# EAGLE design Resume&LinkedIn(PCBboard) (EAGLE 9.3.2)
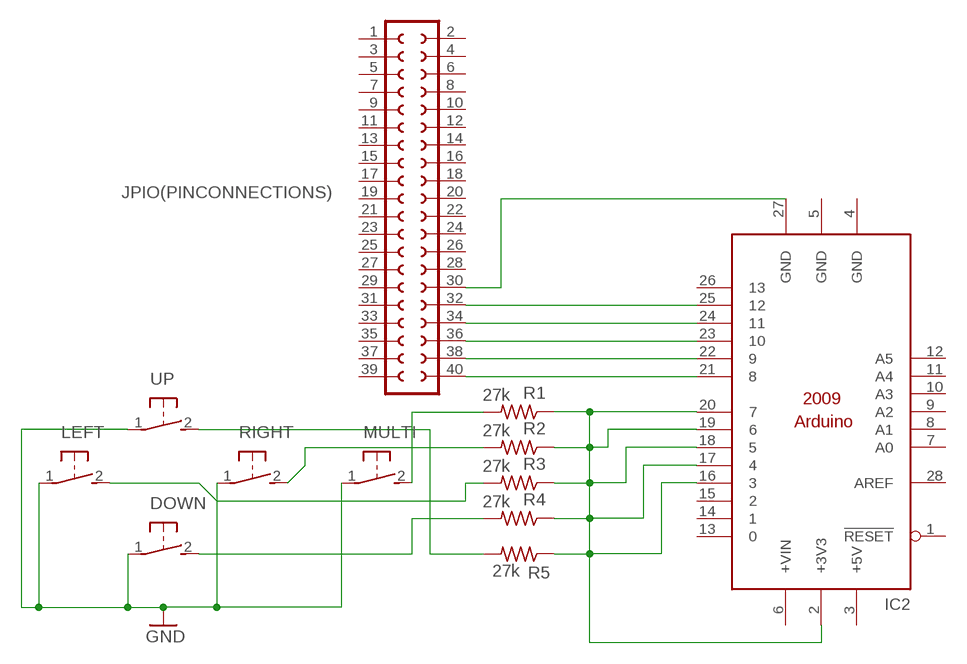
[diagram p0: schematic, sheet 1]

## Parts
DOWN  31-XX  [B3F-31XX]
IC2  ARDUINO2009_10  [ARDUINO2009]
JPIO(PINCONNECTIONS)  SOCKET-40V  [S40V]
LEFT  31-XX  [B3F-31XX]
MULTI  31-XX  [B3F-31XX]
R1  27k  R-US_0204/5  [0204/5]
R2  27k  R-US_0204/5  [0204/5]
R3  27k  R-US_0204/5  [0204/5]
R4  27k  R-US_0204/5  [0204/5]
R5  27k  R-US_0204/5  [0204/5]
RIGHT  31-XX  [B3F-31XX]
UP  31-XX  [B3F-31XX]

## Nets
GND: DOWN.1(P) LEFT.1(P) MULTI.1(P) RIGHT.1(P) UP.1(P)
N$1: IC2.21 JPIO(PINCONNECTIONS).40
N$2: IC2.22 JPIO(PINCONNECTIONS).38
N$3: IC2.23 JPIO(PINCONNECTIONS).36
N$4: IC2.24 JPIO(PINCONNECTIONS).34
N$5: IC2.25 JPIO(PINCONNECTIONS).32
N$6: IC2.27(GND) JPIO(PINCONNECTIONS).30
N$7: IC2.2(+3V3) IC2.16 IC2.17 IC2.18 IC2.19 IC2.20 R1.1 R2.1 R3.1 R4.1 R5.1
N$12: R5.2 UP.2(S)
N$13: DOWN.2(S) R4.2
N$14: LEFT.2(S) R3.2
N$15: R2.2 RIGHT.2(S)
N$16: MULTI.2(S) R1.2
Unconnected: IC2.1(!RESET) IC2.6(+VIN) IC2.7(A0) IC2.8(A1) IC2.9(A2) IC2.10(A3) IC2.11(A4) IC2.12(A5) IC2.13 IC2.14 IC2.15 IC2.26 IC2.28(AREF) JPIO(PINCONNECTIONS).1 JPIO(PINCONNECTIONS).2 JPIO(PINCONNECTIONS).3 JPIO(PINCONNECTIONS).4 JPIO(PINCONNECTIONS).5 JPIO(PINCONNECTIONS).6 JPIO(PINCONNECTIONS).7 JPIO(PINCONNECTIONS).8 JPIO(PINCONNECTIONS).9 JPIO(PINCONNECTIONS).10 JPIO(PINCONNECTIONS).11 JPIO(PINCONNECTIONS).12 JPIO(PINCONNECTIONS).13 JPIO(PINCONNECTIONS).14 JPIO(PINCONNECTIONS).15 JPIO(PINCONNECTIONS).16 JPIO(PINCONNECTIONS).17 JPIO(PINCONNECTIONS).18 JPIO(PINCONNECTIONS).19 JPIO(PINCONNECTIONS).20 JPIO(PINCONNECTIONS).21 JPIO(PINCONNECTIONS).22 JPIO(PINCONNECTIONS).23 JPIO(PINCONNECTIONS).24 JPIO(PINCONNECTIONS).25 JPIO(PINCONNECTIONS).26 JPIO(PINCONNECTIONS).27 JPIO(PINCONNECTIONS).28 JPIO(PINCONNECTIONS).29 JPIO(PINCONNECTIONS).31 JPIO(PINCONNECTIONS).33 JPIO(PINCONNECTIONS).35 JPIO(PINCONNECTIONS).37 JPIO(PINCONNECTIONS).39

## Power pins joined to a net without a drawn wire
+5V: IC2.3(+5V)
GND: IC2.4(GND) IC2.5(GND)

## Library data of the parts
DOWN LEFT MULTI RIGHT UP = switch-omron:31-XX: OMRON SWITCH; MPN: B3F-3100; OC_FARNELL: 959704; OC_NEWARK: 36M3582
IC2 = arduino:ARDUINO2009_1: The Arduino Duemilanove ("2009") is a microcontroller board based on the ATmega168 or ATmega328. - 14 digital input/output pins (of which 6 can be used as PWM outputs) - 6 analog inputs, a 16 MHz crystal oscillator - USB connection - power jack - ISP header - reset button It contains everything needed to support the microcontroller; simply connect it to a computer with a USB cable or power it with a AC-to-DC adapter or battery to get started http://arduino.cc/en/Main/ArduinoBoardDuemilanove
JPIO(PINCONNECTIONS) = con-3m-skt-header:SOCKET-40: 40 pin PCB Socket (3m 85xx/51xx)
R1-R5 = rcl:R-US_: RESISTOR, American symbol; SPICEPREFIX: R

## Board
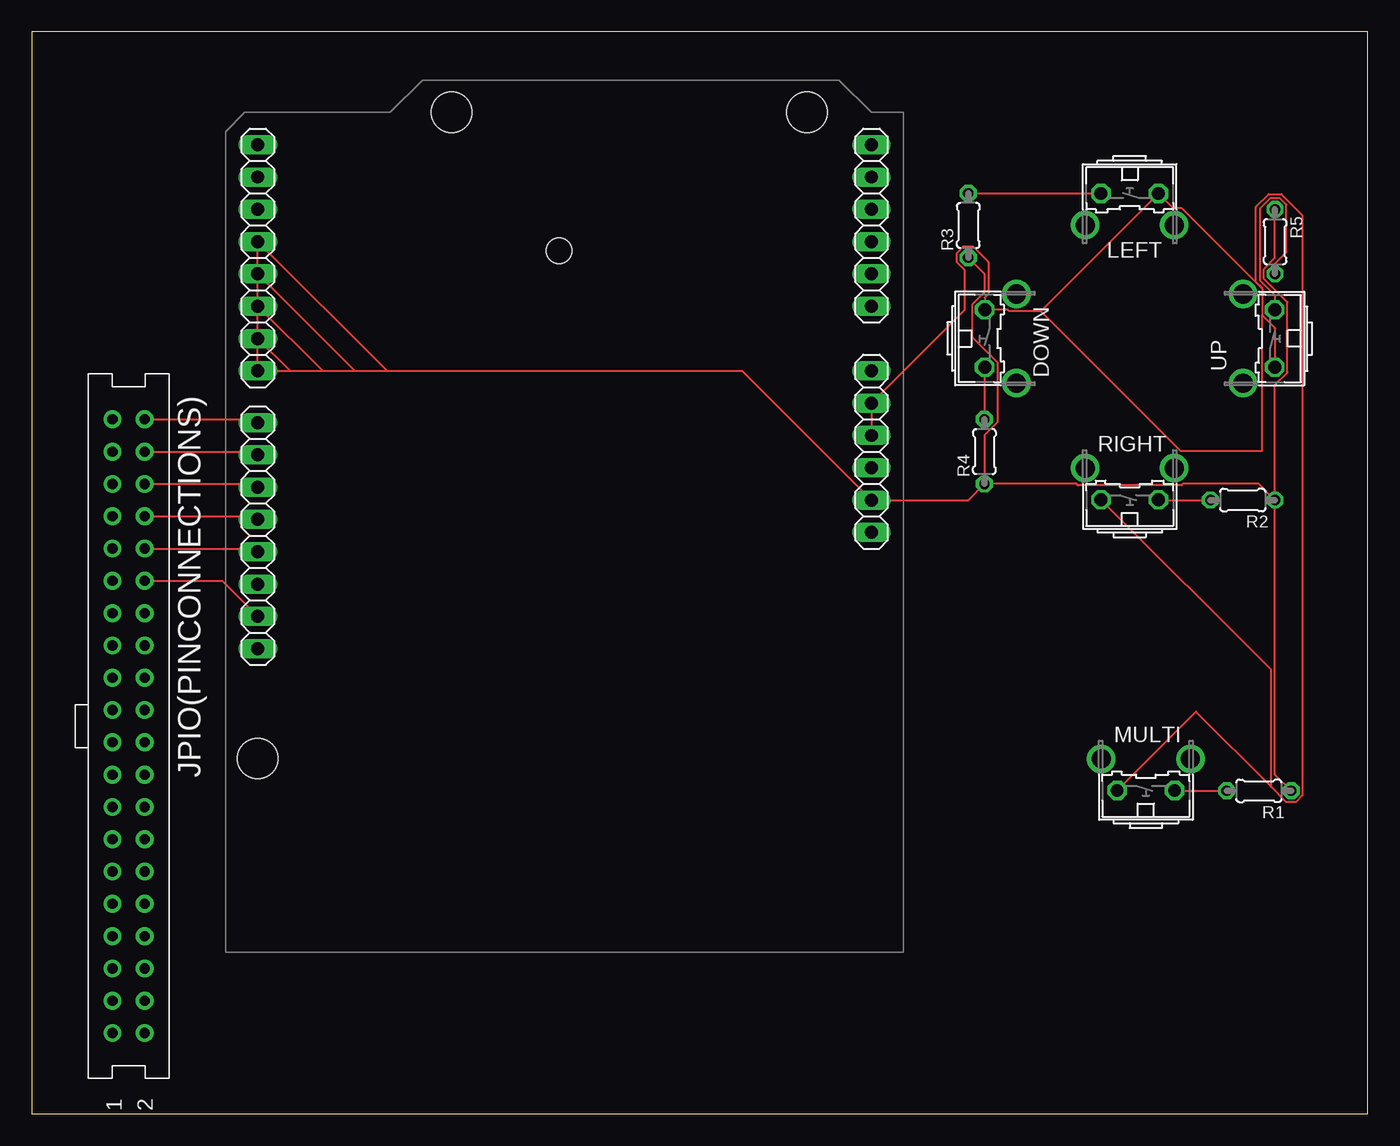
[diagram p1: board, top side]

Size 105.08 x 85.08 mm. Coordinates in mm from the lower left corner, seen from the top.
Outline: 0,0 105.08,0 105.08,85.08 0,85.08 0,0
Copper layers (1*16): Top 0.035mm / dielectric 1.5mm / Bottom 0.035mm
Design rules "default": minimum track width 6mil, minimum drill 0.35mm, track to track 6mil, track to pad 6mil, pad to pad 6mil, via to via 6mil, smd to smd 6mil, copper to edge 40mil, drill to drill 6mil, minimum pad ring 10mil, minimum via ring 8mil, stop-mask expansion 4mil, vias tented up to drill 0mil, thermal gap 10mil

### Footprints (pad centres in the part's own frame; a part is rotated, then mirrored left to right if it is on the bottom)
B3F-31XX = drill 1.016 octagon: 1 -2.261,-1.245; 2 2.261,-1.245 | drill 1.499 pad 2.159: 3 -3.505,1.245; 4 3.505,1.245
ARDUINO2009 = drill 1.016 long: 1 33.02,2.54; 2 35.56,2.54; 3 38.1,2.54; 4 40.64,2.54; 5 43.18,2.54; 6 45.72,2.54; 7 50.8,2.54; 8 53.34,2.54; 9 55.88,2.54; 10 58.42,2.54; 11 60.96,2.54; 12 63.5,2.54; 13 63.5,50.8; 14 60.96,50.8; 15 58.42,50.8; 16 55.88,50.8; 17 53.34,50.8; 18 50.8,50.8; 19 48.26,50.8; 20 45.72,50.8; 21 41.656,50.8; 22 39.116,50.8; 23 36.576,50.8; 24 34.036,50.8; 25 31.496,50.8; 26 28.956,50.8; 27 26.416,50.8; 28 23.876,50.8 | hole 3.2: 15.24,50.8; 66.04,35.56; 66.04,7.62 | hole 2: 55.17,27.114
S40V = drill 0.8 pad 1.4: 1 24.13,-1.27; 2 24.13,1.27; 3 21.59,-1.27; 4 21.59,1.27; 5 19.05,-1.27; 6 19.05,1.27; 7 16.51,-1.27; 8 16.51,1.27; 9 13.97,-1.27; 10 13.97,1.27; 11 11.43,-1.27; 12 11.43,1.27; 13 8.89,-1.27; 14 8.89,1.27; 15 6.35,-1.27; 16 6.35,1.27; 17 3.81,-1.27; 18 3.81,1.27; 19 1.27,-1.27; 20 1.27,1.27; 21 -1.27,-1.27; 22 -1.27,1.27; 23 -3.81,-1.27; 24 -3.81,1.27; 25 -6.35,-1.27; 26 -6.35,1.27; 27 -8.89,-1.27; 28 -8.89,1.27; 29 -11.43,-1.27; 30 -11.43,1.27; 31 -13.97,-1.27; 32 -13.97,1.27; 33 -16.51,-1.27; 34 -16.51,1.27; 35 -19.05,-1.27; 36 -19.05,1.27; 37 -21.59,-1.27; 38 -21.59,1.27; 39 -24.13,-1.27; 40 -24.13,1.27
0204/5 = drill 0.813 octagon: 1 -2.54,0; 2 2.54,0

### Placement (x,y rotation side)
DOWN  76.2,60.96 270 top
IC2  68.58,12.7 90 top
JPIO(PINCONNECTIONS)  7.62,30.48 270 top
LEFT  86.36,71.12 180 top
MULTI  87.63,26.67 0 top
R1  96.52,25.4 180 top
R2  95.25,48.26 180 top
R3  73.66,69.85 90 top
R4  74.93,52.07 90 top
R5  97.79,68.58 270 top
RIGHT  86.36,49.53 0 top
UP  96.52,60.96 90 top

### Tracks (layer width: path | path; a pad name or v marks a point on that pad's centre or on a via)
GND
  Top 0.152: IC2.4 IC2.5 73.38,63.22 73.38,66.33 72.77,66.94 72.77,67.68 73.29,68.2 74.03,68.2 75.23,66.99 75.23,64.47 74.95,64.19 DOWN.1 76.78,63.22 76.88,63.11 79.37,63.11 | 79.37,63.11 LEFT.1 89.76,71.23 90.42,71.23 96.77,64.88 | 96.77,64.88 96.77,62.81 | MULTI.1 91.57,31.63 97.48,25.72 | 96.77,62.81 97.79,61.79 97.77,61.77 UP.1 | 96.77,64.88 96.77,64.94 96.29,65.42 96.29,71.31 97.3,72.31 98.28,72.31 99.95,70.65 99.95,25.03 99.43,24.51 98.69,24.51 97.48,25.72 | 96.77,62.81 96.77,52.13 90.35,52.13 79.37,63.11 | 97.48,25.72 97.48,34.9 RIGHT.1
N$1
  Top 0.152: JPIO(PINCONNECTIONS).40 17.53,54.61 IC2.21
N$2
  Top 0.152: JPIO(PINCONNECTIONS).38 17.53,52.07 IC2.22
N$3
  Top 0.152: JPIO(PINCONNECTIONS).36 17.53,49.53 IC2.23
N$4
  Top 0.152: JPIO(PINCONNECTIONS).34 17.53,46.99 IC2.24
N$5
  Top 0.152: JPIO(PINCONNECTIONS).32 17.53,44.45 IC2.25
N$6
  Top 0.152: JPIO(PINCONNECTIONS).30 14.99,41.91 IC2.27
N$7
  Top 0.152: R4.1 73.66,48.26 IC2.2 55.88,58.42 29.21,58.42 27.94,58.42 | R1.1 97.79,26.67 R2.1 | R2.1 97.79,57.32 98.75,58.29 98.75,63.82 96.9,65.67 96.9,66.41 97.79,67.3 R5.1 | R2.1 96.52,49.53 90.53,49.53 90.42,49.42 82.3,49.42 82.19,49.53 R4.1 | R3.1 74.93,66.04 74.93,64.6 73.97,63.63 73.97,61.09 75.95,59.11 75.95,54.37 74.93,53.35 R4.1 | 20.32,58.42 IC2.20 IC2.16 27.94,58.42 | 20.32,58.42 22.86,58.42 | 22.86,58.42 25.4,58.42 | 25.4,58.42 27.94,58.42 | IC2.19 20.32,58.42 | IC2.18 22.86,58.42 | IC2.17 25.4,58.42
N$12
  Top 0.152: R5.2 97.77,66.02 97.77,66.84 98.68,67.75 98.68,71.49 98.16,72.01 97.42,72.01 96.6,71.18 96.6,65.55 97.77,64.38 UP.2
N$13
  Top 0.152: R4.2 74.95,54.63 DOWN.2
N$14
  Top 0.152: R3.2 84.07,72.39 LEFT.2
N$15
  Top 0.152: RIGHT.2 88.65,48.26 R2.2
N$16
  Top 0.152: MULTI.2 89.92,25.4 R1.2